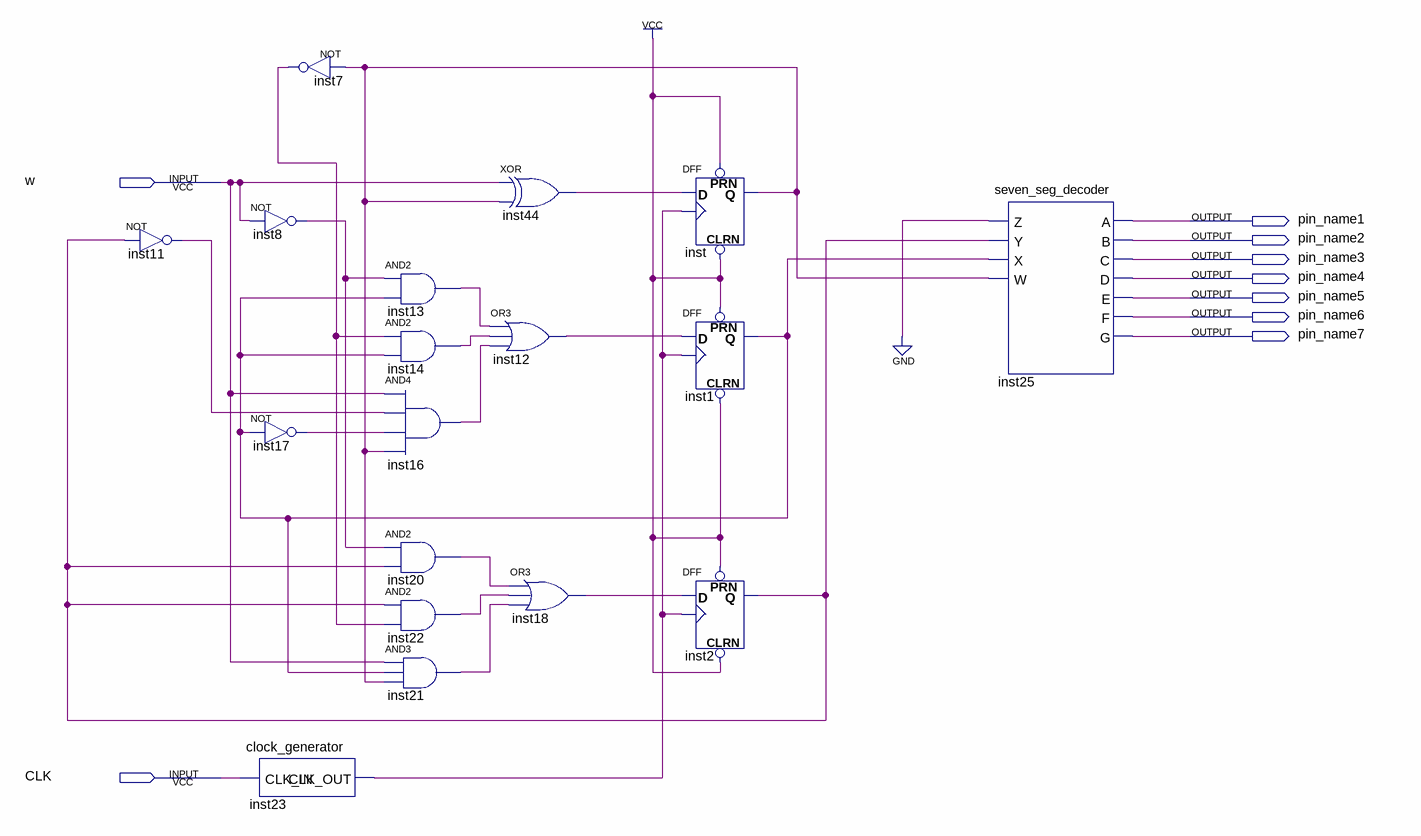
[diagram p0: schematic sheet]
// Quartus schematic step1.bdf as structural Verilog: 18 symbols, 9 pins
module step1 (
  input  w,
  input  CLK,
  output pin_name1,
  output pin_name2,
  output pin_name3,
  output pin_name4,
  output pin_name5,
  output pin_name6,
  output pin_name7
);

  wire inst1_q, inst2_q, inst7_out, inst8_out, inst11_out, inst12_out, inst13_out, inst14_out, inst16_out,
       inst17_out, inst18_out, inst20_out, inst21_out, inst22_out, inst23_clk_out, inst44_out, inst_q;

  not inst11 (inst11_out, inst2_q);
  not inst7 (inst7_out, inst_q);
  not inst8 (inst8_out, w);
  not inst17 (inst17_out, inst1_q);
  clock_generator inst23 (.CLK_IN(CLK), .CLK_OUT(inst23_clk_out));
  and inst13 (inst13_out, inst8_out, inst1_q);
  and inst14 (inst14_out, inst7_out, inst1_q);
  and inst16 (inst16_out, w, inst11_out, inst17_out, inst_q);
  and inst20 (inst20_out, inst8_out, inst2_q);
  and inst22 (inst22_out, inst2_q, inst7_out);
  and inst21 (inst21_out, w, inst1_q, inst_q);
  xor inst44 (inst44_out, w, inst_q);
  or inst12 (inst12_out, inst13_out, inst14_out, inst16_out);
  or inst18 (inst18_out, inst20_out, inst22_out, inst21_out);
  DFF inst (.CLRN(1'b1), .CLK(inst23_clk_out), .D(inst44_out), .PRN(1'b1), .Q(inst_q));
  DFF inst1 (.CLRN(1'b1), .CLK(inst23_clk_out), .D(inst12_out), .PRN(1'b1), .Q(inst1_q));
  DFF inst2 (.CLRN(1'b1), .CLK(inst23_clk_out), .D(inst18_out), .PRN(1'b1), .Q(inst2_q));
  seven_seg_decoder inst25 (
    .Z(1'b0), .Y(inst2_q), .X(inst1_q), .W(inst_q), .A(pin_name1), .B(pin_name2), .C(pin_name3),
    .D(pin_name4), .E(pin_name5), .F(pin_name6), .G(pin_name7));
endmodule
